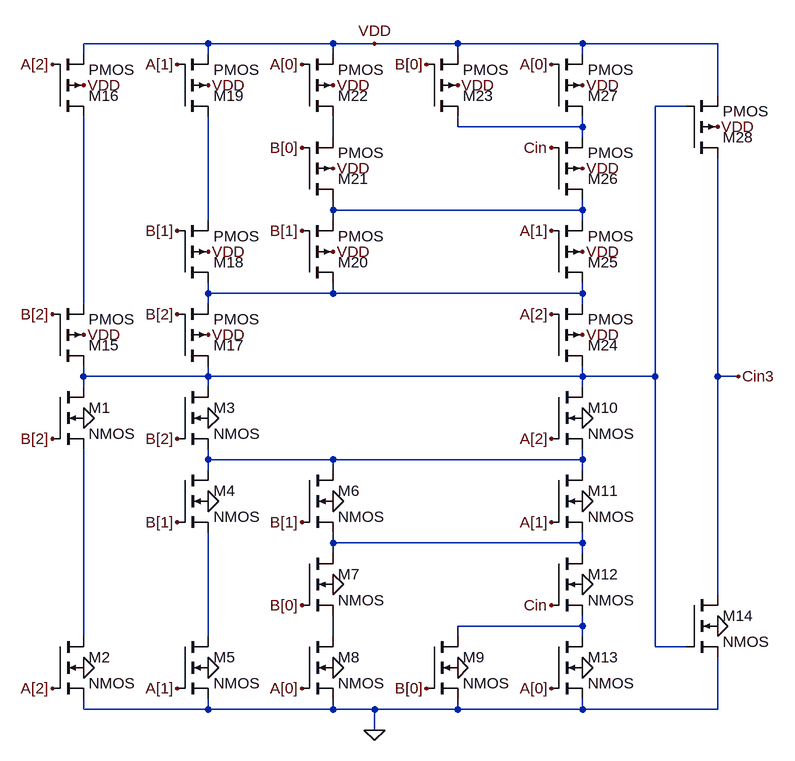
[diagram p0: schematic Carry_in3_pseudo.asc]
Carry_in3_pseudo.asc, the LTspice schematic file:
Version 4
SHEET 1 1328 724
WIRE 80 -352 -112 -352
WIRE 272 -352 80 -352
WIRE 336 -352 272 -352
WIRE 464 -352 336 -352
WIRE 656 -352 464 -352
WIRE 864 -352 656 -352
WIRE -112 -336 -112 -352
WIRE 80 -336 80 -352
WIRE 272 -336 272 -352
WIRE 464 -336 464 -352
WIRE 656 -336 656 -352
WIRE 864 -272 864 -352
WIRE 816 -256 768 -256
WIRE 464 -224 464 -240
WIRE 656 -224 656 -240
WIRE 656 -224 464 -224
WIRE 272 -208 272 -240
WIRE 656 -208 656 -224
WIRE 272 -96 272 -112
WIRE 656 -96 656 -112
WIRE 656 -96 272 -96
WIRE 80 -80 80 -240
WIRE 272 -80 272 -96
WIRE 656 -80 656 -96
WIRE 80 32 80 16
WIRE 272 32 272 16
WIRE 272 32 80 32
WIRE 656 32 656 16
WIRE 656 32 272 32
WIRE -112 48 -112 -240
WIRE 80 48 80 32
WIRE 656 48 656 32
WIRE -112 160 -112 144
WIRE 80 160 80 144
WIRE 80 160 -112 160
WIRE 656 160 656 144
WIRE 656 160 80 160
WIRE 768 160 768 -256
WIRE 768 160 656 160
WIRE 864 160 864 -176
WIRE 896 160 864 160
WIRE -112 176 -112 160
WIRE 80 176 80 160
WIRE 656 176 656 160
WIRE 80 288 80 272
WIRE 272 288 80 288
WIRE 656 288 656 272
WIRE 656 288 272 288
WIRE 80 304 80 288
WIRE 272 304 272 288
WIRE 656 304 656 288
WIRE 272 416 272 400
WIRE 656 416 656 400
WIRE 656 416 272 416
WIRE 272 432 272 416
WIRE 656 432 656 416
WIRE 864 496 864 160
WIRE 656 544 656 528
WIRE 656 544 464 544
WIRE -112 560 -112 272
WIRE 80 560 80 400
WIRE 272 560 272 528
WIRE 464 560 464 544
WIRE 656 560 656 544
WIRE 768 576 768 160
WIRE 816 576 768 576
WIRE -112 672 -112 656
WIRE 80 672 80 656
WIRE 80 672 -112 672
WIRE 272 672 272 656
WIRE 272 672 80 672
WIRE 336 672 272 672
WIRE 464 672 464 656
WIRE 464 672 336 672
WIRE 656 672 656 656
WIRE 656 672 464 672
WIRE 864 672 864 592
WIRE 864 672 656 672
WIRE 336 704 336 672
FLAG 656 608 0
FLAG 656 480 0
FLAG 656 352 0
FLAG 656 224 0
FLAG 864 544 0
FLAG 464 608 0
FLAG 272 608 0
FLAG 272 480 0
FLAG 272 352 0
FLAG 80 352 0
FLAG 80 224 0
FLAG 80 608 0
FLAG -112 608 0
FLAG -112 224 0
FLAG 656 96 VDD
FLAG 656 -160 VDD
FLAG 656 -288 VDD
FLAG 656 -32 VDD
FLAG 464 -288 VDD
FLAG 272 -288 VDD
FLAG 272 -160 VDD
FLAG 272 -32 VDD
FLAG 80 -288 VDD
FLAG 80 -32 VDD
FLAG 80 96 VDD
FLAG -112 96 VDD
FLAG -112 -288 VDD
FLAG 336 -352 VDD
FLAG 864 -224 VDD
FLAG 336 704 0
FLAG 608 640 A[0]
FLAG 224 640 A[0]
FLAG 608 -320 A[0]
FLAG 224 -320 A[0]
FLAG 608 384 A[1]
FLAG 32 640 A[1]
FLAG 608 -64 A[1]
FLAG 32 -320 A[1]
FLAG -160 640 A[2]
FLAG 608 256 A[2]
FLAG -160 -320 A[2]
FLAG 608 64 A[2]
FLAG 416 640 B[0]
FLAG 224 512 B[0]
FLAG 224 -192 B[0]
FLAG 416 -320 B[0]
FLAG 224 384 B[1]
FLAG 32 384 B[1]
FLAG 224 -64 B[1]
FLAG 32 -64 B[1]
FLAG 32 256 B[2]
FLAG 32 64 B[2]
FLAG -160 64 B[2]
FLAG -160 256 B[2]
FLAG 608 -192 Cin
FLAG 608 512 Cin
FLAG 896 160 Cin3
SYMBOL nmos4 -160 176 R0
SYMATTR InstName M1
SYMBOL nmos4 -160 560 R0
SYMATTR InstName M2
SYMBOL nmos4 32 176 R0
SYMATTR InstName M3
SYMBOL nmos4 32 304 R0
SYMATTR InstName M4
SYMBOL nmos4 32 560 R0
SYMATTR InstName M5
SYMBOL nmos4 224 304 R0
SYMATTR InstName M6
SYMBOL nmos4 224 432 R0
SYMATTR InstName M7
SYMBOL nmos4 224 560 R0
SYMATTR InstName M8
SYMBOL nmos4 416 560 R0
SYMATTR InstName M9
SYMBOL nmos4 608 176 R0
SYMATTR InstName M10
SYMBOL nmos4 608 304 R0
SYMATTR InstName M11
SYMBOL nmos4 608 432 R0
SYMATTR InstName M12
SYMBOL nmos4 608 560 R0
SYMATTR InstName M13
SYMBOL nmos4 816 496 R0
SYMATTR InstName M14
SYMBOL pmos4 -160 144 M180
SYMATTR InstName M15
SYMBOL pmos4 -160 -240 M180
SYMATTR InstName M16
SYMBOL pmos4 32 144 M180
SYMATTR InstName M17
SYMBOL pmos4 32 16 M180
SYMATTR InstName M18
SYMBOL pmos4 32 -240 M180
SYMATTR InstName M19
SYMBOL pmos4 224 16 M180
SYMATTR InstName M20
SYMBOL pmos4 224 -112 M180
SYMATTR InstName M21
SYMBOL pmos4 224 -240 M180
SYMATTR InstName M22
SYMBOL pmos4 416 -240 M180
SYMATTR InstName M23
SYMBOL pmos4 608 144 M180
SYMATTR InstName M24
SYMBOL pmos4 608 16 M180
SYMATTR InstName M25
SYMBOL pmos4 608 -112 M180
SYMATTR InstName M26
SYMBOL pmos4 608 -240 M180
SYMATTR InstName M27
SYMBOL pmos4 816 -176 M180
SYMATTR InstName M28

The netlist it stands for:
* Carry_in3_pseudo.asc
M1 N001 B[2] N011 0 NMOS
M2 N011 A[2] 0 0 NMOS
M3 N001 B[2] N008 0 NMOS
M4 N008 B[1] N012 0 NMOS
M5 N012 A[1] 0 0 NMOS
M6 N008 B[1] N009 0 NMOS
M7 N009 B[0] N013 0 NMOS
M8 N013 A[0] 0 0 NMOS
M9 N010 B[0] 0 0 NMOS
M10 N001 A[2] N008 0 NMOS
M11 N008 A[1] N009 0 NMOS
M12 N009 Cin N010 0 NMOS
M13 N010 A[0] 0 0 NMOS
M14 Cin3 N001 0 0 NMOS
M15 N001 B[2] N007 VDD PMOS
M16 N007 A[2] VDD VDD PMOS
M17 N001 B[2] N006 VDD PMOS
M18 N006 B[1] N005 VDD PMOS
M19 N005 A[1] VDD VDD PMOS
M20 N006 B[1] N004 VDD PMOS
M21 N004 B[0] N003 VDD PMOS
M22 N003 A[0] VDD VDD PMOS
M23 N002 B[0] VDD VDD PMOS
M24 N001 A[2] N006 VDD PMOS
M25 N006 A[1] N004 VDD PMOS
M26 N004 Cin N002 VDD PMOS
M27 N002 A[0] VDD VDD PMOS
M28 Cin3 N001 VDD VDD PMOS
.model NMOS NMOS
.model PMOS PMOS
.lib standard.mos
.backanno
.end